# EasyEDA Pro project ProPrj_mousring_2025-06-12.epro

# Schematic Schematic1
Board Name: Board1; Create Date: 2025-04-29; Page Name: P1; Project Name: mousring; Schematic Name: Schematic1; Update Date: 2025-06-09; Company: EasyEDA.com; Page Size: A4; Version: V1.0
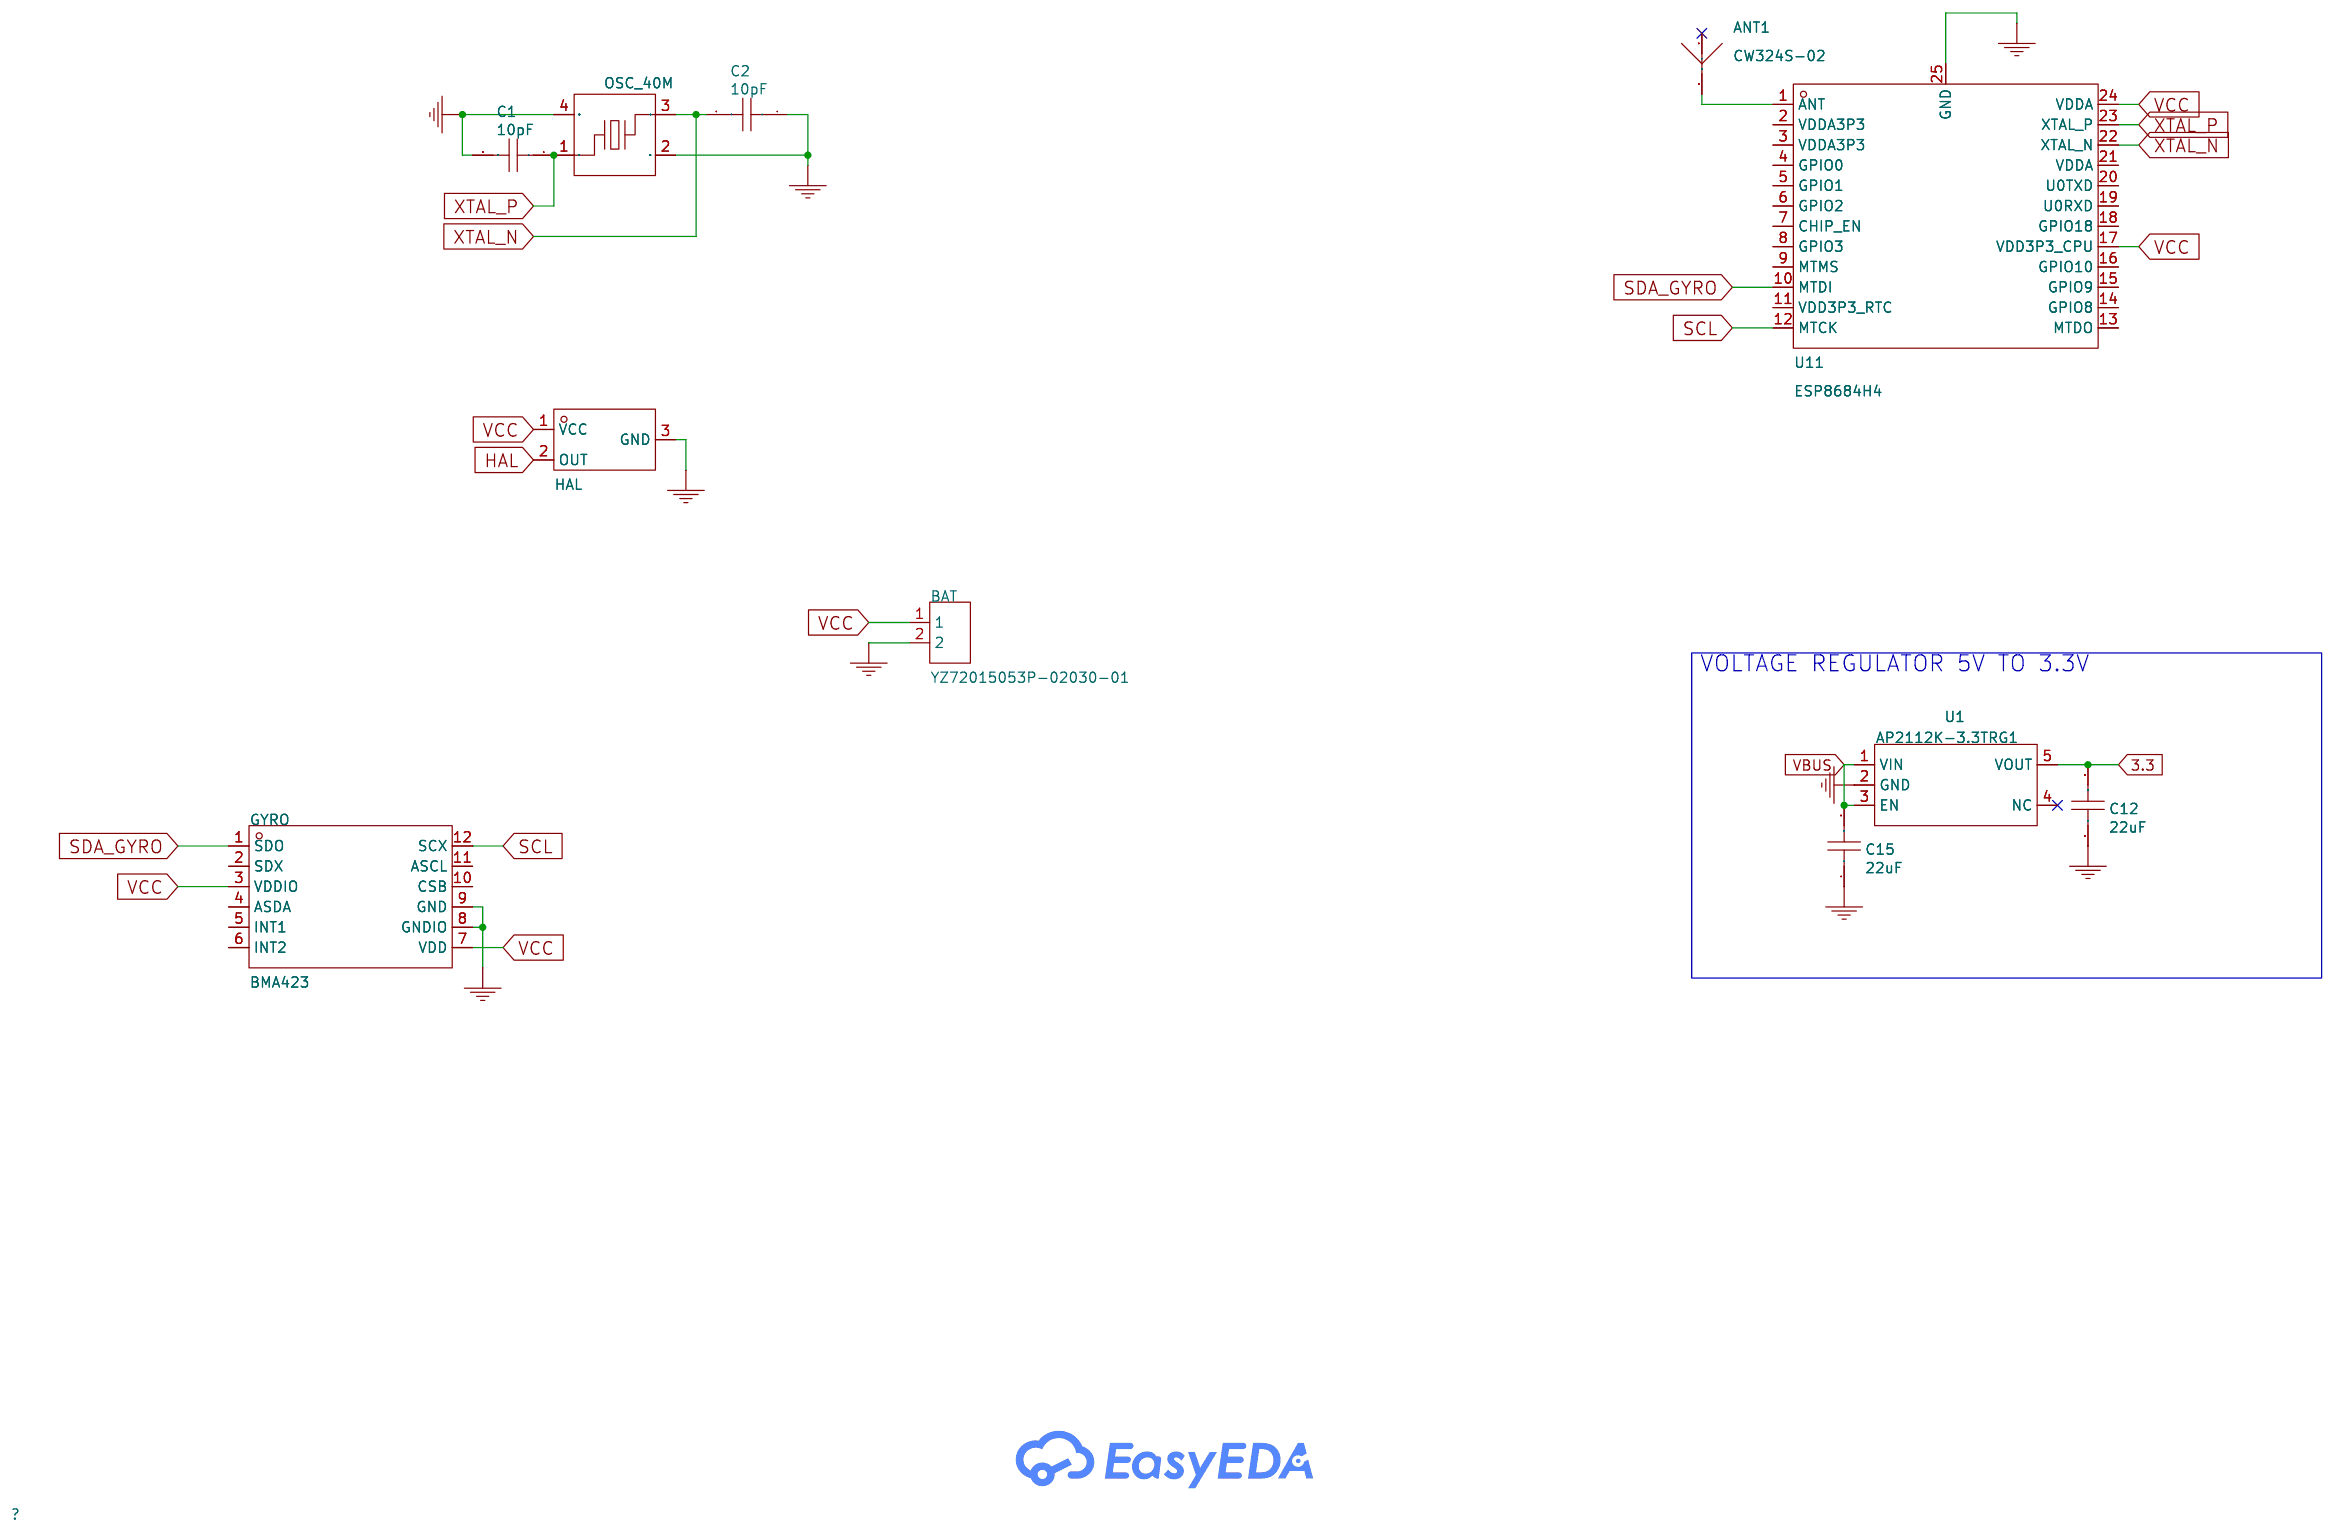
[diagram p0: schematic sheet]

## Parts
ANT1  CW324S-02  [ANT-SMD_L3.2-W1.6_CW324S-01]
BAT  YZ72015053P-02030-01  [POGO-SMD_2P-P3.00_YZ72015053P-02030-01]
C1  10pF  [C0402]
C2  10pF  [C0402]
C12  22uF  [C0603]
C15  22uF  [C0603]
GYRO  BMA423  [LGA-12_L2.0-W2.0-P0.50-BL]
U1  AP2112K-3.3TRG1  [SOT-25-5_L2.9-W1.6-P0.95-LS2.8-BL]
U9  HAL  [SOT-23-3_L2.9-W1.6-P1.90-LS2.9-BL]
U11  ESP8684H4  [QFN-24_L4.0-W4.0-P0.50-TL-EP2.8]
X1  OSC_40M  [CRYSTAL-SMD_4P-L1.6-W1.2-BL]

## Library data of the parts
ANT1 = CW324S-02: LCSC Part Name: LXC(连兴创)陶瓷SMT天线-CW324S; Supplier Part: C42379500; Manufacturer: LXC(连兴创); Datasheet: https://atta.szlcsc.com/upload/public/pdf/source/20241122/8212D1C9576862F7E470A8A9A6B7A996.pdf; Supplier: LCSC
BAT = YZ72015053P-02030-01: Type:Spring loaded pin (POGO PIN) Number of Pins:2P Pitch:3mm Overall Length/Height:5.3mm Operational Height:3.5mm Contact Resistance:50mΩ Elastic Life:10,000 times Current Rating:1A Voltage Rating:12V Contact Material:Brass Contact Plating:Gold Operating; LCSC Part Name: 2pin插件弹簧顶针连接器; Supplier Part: C5200659; Manufacturer: Xinyangze(鑫扬泽); JLCPCB Part Class: Extended Part; Datasheet: https://atta.szlcsc.com/upload/public/pdf/source/20221019/4DC865334C9A28BD5FDFE5DC00A9664F.pdf; Supplier: LCSC; Type: Spring loaded pin (POGO PIN); Number of Pins: 2P; Pitch: 3mm; Overall Length/Height: 5.3mm; Operational Height: 3.5mm; Contact Resistance: 50mΩ; Elastic Life: 10,000 times; Current Rating: 1A; Voltage Rating: 12V; Contact Material: Brass; Contact Plating: Gold; Operating Temperature: -20℃~+70℃
C1 C2 = 10pF: Supplier: LCSC; Manufacturer: SAMSUNG(三星); Manufacturer Part: CL05C100JB5NNNC; Supplier Part: C32949; JLCPCB Part Class: Basic Part; link: https://lcsc.com/eda_search?q=C32949&%26type=1&ref=editor; nameAlias: Value; spicePre: C; spiceSymbolName: CL05C100JB5NNNC
C12 C15 = 22uF: Supplier: LCSC; Manufacturer: SAMSUNG(三星); Manufacturer Part: CL10A226MQ8NRNC; Supplier Part: C59461; JLCPCB Part Class: Basic Part; nameAlias: Value; spicePre: C; spiceSymbolName: CL10A226MQ8NRNC
GYRO = BMA423: Supplier Part: C189517; Manufacturer: Bosch(博世); Supplier Footprint: LGA-12(2x2); JLCPCB Part Class: Extended Part; Datasheet: https://atta.szlcsc.com/upload/public/pdf/source/20180628/C189517_D4E5A05318518518FDA0E175D3C2B3DB.pdf; Supplier: LCSC
U1 = AP2112K-3.3TRG1: Supplier: LCSC; Manufacturer: DIODES(美台); Supplier Part: C51118; JLCPCB Part Class: Extended Part; Contributor: LCSC; spicePre: U
U9 = HAL3144E: Voltage - Supply:3.8V~40V Voltage - Supply:3.8V~40V Operation Points:160Gs Operation Points:160Gs Release Points:40Gs Release Points:40Gs Operating Temperature:-40℃~+150℃ Operating Temperature:-40℃~+150℃; Supplier Part: C2843419; Manufacturer: Hallwee(霍尔微电子); Supplier Footprint: SOT-23; JLCPCB Part Class: Extended Part; Datasheet: https://atta.szlcsc.com/upload/public/pdf/source/20230614/A78D6DD088F58E7DA53C0C3D5890D47D.pdf; Supplier: LCSC; Voltage - Supply: 3.8V~40V; Operation Points: 160Gs; Release Points: 40Gs; Operating Temperature: -40℃~+150℃
U11 = ESP8684H4: Frequency Range:2.412GHz~2.484GHz Frequency Range:2.412GHz~2.484GHz Interface:ADC；SPI；I2C；PWM；UART Voltage - Supply:3V~3.6V Voltage - Supply:3V~3.6V Applications:WiFi；Bluetooth Output Power:21.5dBm Data Rate:72.2Mbps Current Of Transmitting:370mA Sensitiv; Supplier Part: C3013914; Manufacturer: ESPRESSIF(乐鑫); Supplier Footprint: SMD; JLCPCB Part Class: Extended Part; Datasheet: https://atta.szlcsc.com/upload/public/pdf/source/20241030/0403F47588ED3144E213BDA8AAC70CC1.pdf; Supplier: LCSC; Frequency Range: 2.412GHz~2.484GHz; Interface: ADC；SPI；I2C；PWM；UART; Voltage - Supply: 3V~3.6V; Applications: WiFi；Bluetooth; Output Power: 21.5dBm; Data Rate: 72.2Mbps; Current Of Transmitting: 370mA; Sensitivity: -99dBm; Receive Current: 65mA; Typical Application Frequency: 2.4GHz; Operating Temperature: -40℃~+105℃
X1 = 40MHz: Supplier: LCSC; Supplier Part: C7301927; Manufacturer: SCTF(星通时频); Manufacturer Part: SX0B40.000F1010F30; JLCPCB Part Class: Extended Part; nameAlias: Value; Contributor: lcsc; spicePre: X; spiceSymbolName: SX0B40.000F1010F30

## Nets
GND: BAT.2 C1.2 C2.1 C12.1 C15.1 GYRO.8(GNDIO) GYRO.9(GND) U1.2(GND) U9.3(GND) U11.25(GND) X1.2(GND) X1.4(GND)
VBUS: C15.2 U1.1(VIN) U1.3(EN)
VCC: BAT.1 GYRO.3(VDDIO) GYRO.7(VDD) U9.1(VCC) U11.17(VDD3P3_CPU) U11.24(VDDA)
3.3: C12.2 U1.5(VOUT)
HAL: U9.2(OUT)
SCL: GYRO.12(SCX) U11.12(MTCK)
SDA_GYRO: GYRO.1(SDO) U11.10(MTDI)
XTAL_N: C2.2 U11.22(XTAL_N) X1.3
XTAL_P: C1.1 U11.23(XTAL_P) X1.1
$1N6789: ANT1.1(ANT) U11.1(ANT)

Not connected (* = marked no-connect by the designer): ANT1 2*; GYRO 2(SDX) 4(ASDA) 5(INT1) 6(INT2) 10(CSB) 11(ASCL); U1 4(NC)*; U11 2(VDDA3P3) 3(VDDA3P3) 4(GPIO0) 5(GPIO1) 6(GPIO2) 7(CHIP_EN) 8(GPIO3) 9(MTMS) 11(VDD3P3_RTC) 13(MTDO) 14(GPIO8) 15(GPIO9) 16(GPIO10) 18(GPIO18) 19(U0RXD) 20(U0TXD) 21(VDDA)

## Notes on the sheet
- VOLTAGE REGULATOR 5V TO 3.3V

# Board PCB9
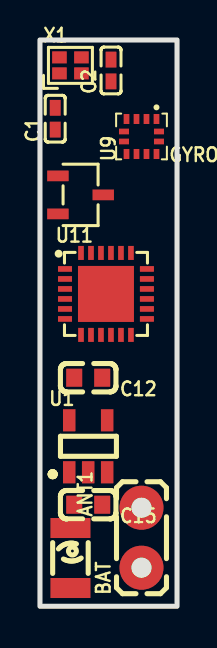
[diagram p1: board, top side]
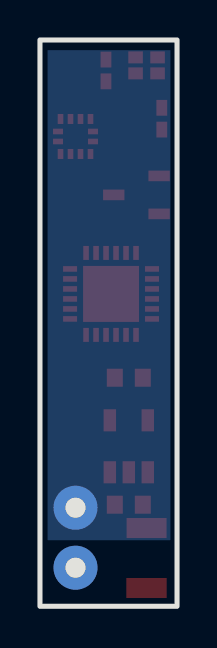
[diagram p2: board, bottom side, seen from below]

Outline 6.86 x 28.32 mm; copper layers: Top Layer, Inner1, Inner2, Bottom Layer. Coordinates in mm from the lower left corner of the outline.
Outline path: rectangle 0,28.32 6.86,0
Stack: Top Layer 0.035mm Outer layer thickness 1oz / Dielectric1 0.2104mm 7628 RC49% 8.6mil / Inner1 0.0152mm Inner layer thickness / Dielectric2 1.065mm 1.1mm H/HOZ Copper / Inner2 0.0152mm Inner layer thickness / Dielectric3 0.2104mm 7628 RC49% 8.6mil / Bottom Layer 0.035mm Outer layer thickness 1oz

## Design rules (mm)
template: JLCPCB Capability(Two Layers Board)
spacing copperThickness1oz (default): track to track 0.102, other pairs 0.152 to 0.3
spacing copperThickness2oz: track to track 0.203, other pairs 0.152 to 0.3
track width copperThickness1oz (default): min 0.127, default 0.254, max 2.54
track width copperThickness2oz: min 0.203, default 0.254, max 2.54
differential pair differentialPair (default): width min 0.127, default 0.254, max 2.54; gap min 0.152, default 0.152
via viaSize (default): diameter min 0.5, default 0.61, max 10; hole min 0.3, default 0.305, max 6.3

## Placement (name value [footprint] x y rotation side)
ANT1  CW324S-02  [ANT-SMD_L3.2-W1.6_CW324S-01]  1.52 2.41 270 top
BAT  YZ72015053P-02030-01  [POGO-SMD_2P-P3.00_YZ72015053P-02030-01]  5.08 3.43 90 top
C1  10pF  [C0402]  0.76 24.38 90 top
C2  10pF  [C0402]  3.56 26.8 90 top
C12  22uF  [C0603]  2.41 11.43 180 top
C15  22uF  [C0603]  2.41 5.08 180 top
GYRO  BMA423  [LGA-12_L2.0-W2.0-P0.50-BL]  5.08 23.5 180 top
U1  AP2112K-3.3TRG1  [SOT-25-5_L2.9-W1.6-P0.95-LS2.8-BL]  2.41 8 0 top
U9  HAL  [SOT-23-3_L2.9-W1.6-P1.90-LS2.9-BL]  2.03 20.57 270 top
U11  ESP8684H4  [QFN-24_L4.0-W4.0-P0.50-TL-EP2.8]  3.3 15.62 0 top
X1  OSC_40M  [CRYSTAL-SMD_4P-L1.6-W1.2-BL]  1.52 27.05 0 top

## Footprints (pads in the part's own frame, mm; a bottom-side part is the same pattern mirrored in y, then rotated)
ANT-SMD_L3.2-W1.6_CW324S-01
  rect 1x2 smd: 1(-1.5,0) 2(1.5,0)
C0402
  rect 0.79x0.54 smd: 1(-0.545,0) 2(0.545,0)
C0603
  rect 0.8x0.9 smd: 1(-0.7,0) 2(0.7,0)
CRYSTAL-SMD_4P-L1.6-W1.2-BL
  rect 0.73x0.6 smd: 1(-0.55,-0.4) 2(0.55,-0.4) 3(0.55,0.4) 4(-0.55,0.4)
LGA-12_L2.0-W2.0-P0.50-BL
  rect 0.28x0.5 smd: 1(-0.75,-0.875) 2(-0.25,-0.875) 3(0.25,-0.875) 4(0.75,-0.875) 7(0.75,0.875) 8(0.25,0.875) 9(-0.25,0.875) 10(-0.75,0.875)
  rect 0.5x0.28 smd: 5(0.875,-0.25) 6(0.875,0.25) 11(-0.875,0.25) 12(-0.875,-0.25)
POGO-SMD_2P-P3.00_YZ72015053P-02030-01
  round 2.2 hole 1: 1(-1.5,0) 2(1.5,0)
QFN-24_L4.0-W4.0-P0.50-TL-EP2.8
  rect 0.7x0.28 smd: 1(-2.05,1.25) 2(-2.05,0.75) 3(-2.05,0.25) 4(-2.05,-0.25) 5(-2.05,-0.75) 6(-2.05,-1.25) 13(2.05,-1.25) 14(2.05,-0.75) 15(2.05,-0.25) 16(2.05,0.25) 17(2.05,0.75) 18(2.05,1.25)
  rect 0.28x0.7 smd: 7(-1.25,-2.05) 8(-0.75,-2.05) 9(-0.25,-2.05) 10(0.25,-2.05) 11(0.75,-2.05) 12(1.25,-2.05) 19(1.25,2.05) 20(0.75,2.05) 21(0.25,2.05) 22(-0.25,2.05) 23(-0.75,2.05) 24(-1.25,2.05)
  rect 2.8x2.8 smd: 25(0,0)
SOT-23-3_L2.9-W1.6-P1.90-LS2.9-BL
  rect 0.532x1.07 smd: 1(-0.95,-1.135) 2(0.95,-1.135) 3(0,1.135)
SOT-25-5_L2.9-W1.6-P0.95-LS2.8-BL
  rect 0.623x1.105 smd: 1(-0.95,-1.3) 2(-0.001,-1.3) 3(0.95,-1.3) 4(0.95,1.3) 5(-0.95,1.3)

## Nets
As in the schematic.

Pads without a net: ANT1 2; GYRO 2 4 5 6 10 11; U1 4; U11 2 3 4 5 6 7 8 9 11 13 14 15 16 18 19 20 21

## Copper pours and planes (outline as drawn; the poured copper is in the pictures)
GND on Bottom Layer: 0.33,27.81 6.48,27.81 6.48,3.3 0.33,3.3
